# Altium schematic sheet PowerFull_car_engineSteering.SchDoc
size A4
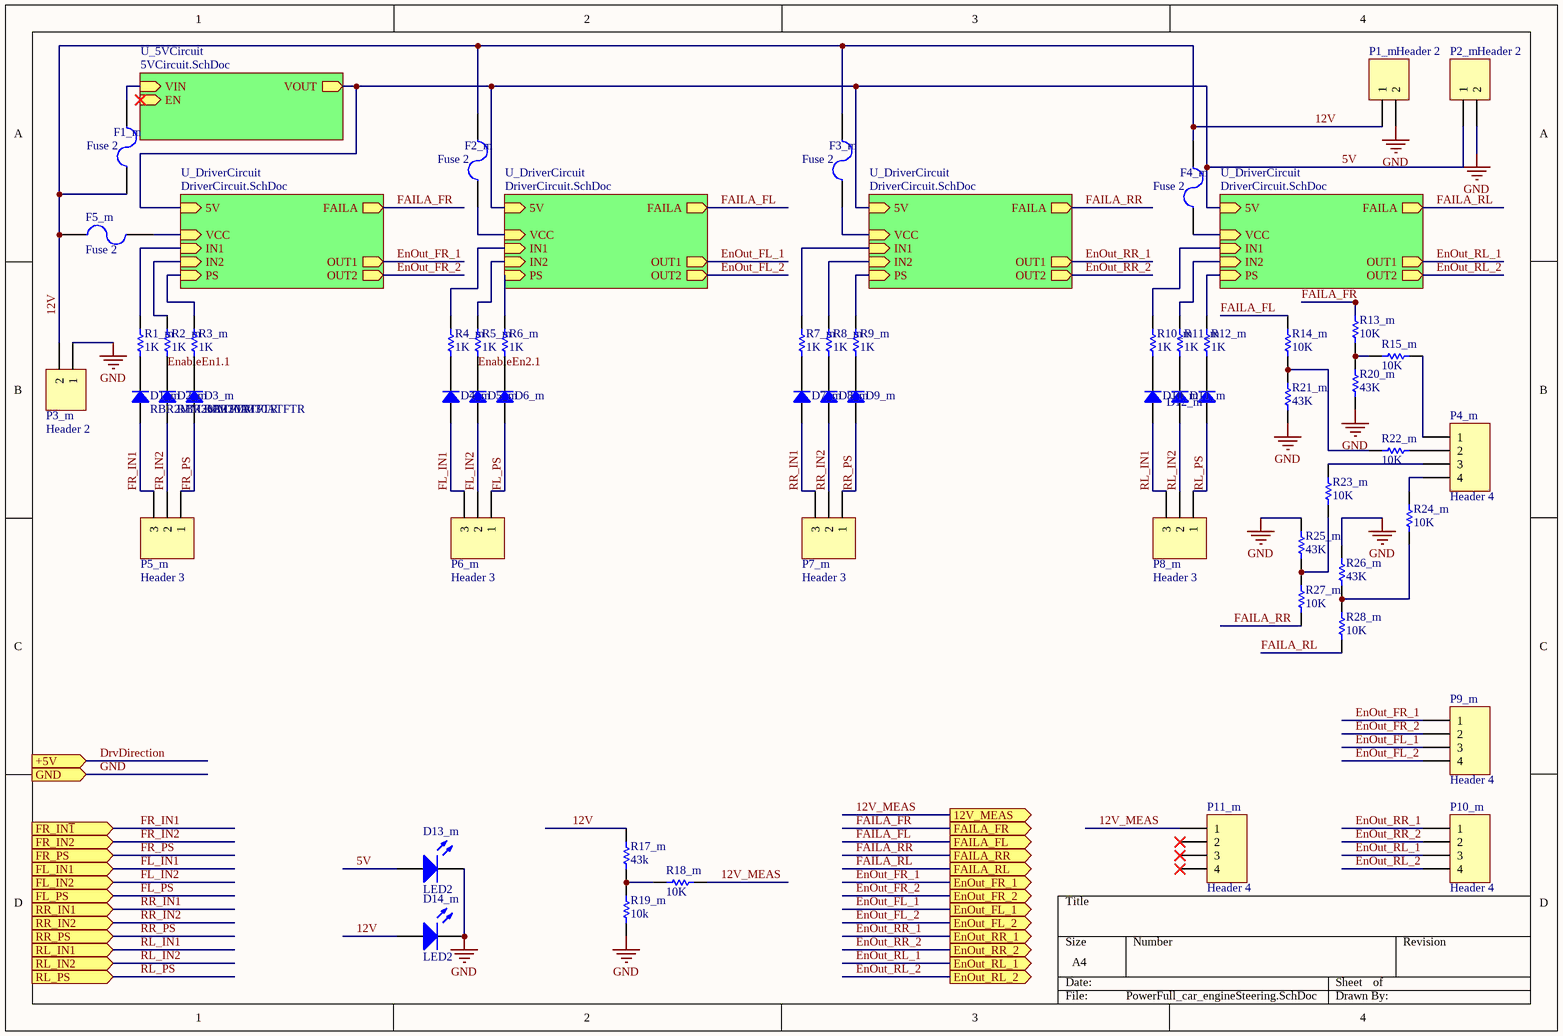
[diagram p0: PowerFull_car_engineSteering.SchDoc]

## Parts
D1_m  RBR2MM30ATFTR  [SOD123F]
D2_m  RBR2MM30ATFTR  [SOD123F]
D3_m  RBR2MM30ATFTR  [SOD123F]
D4_m  RBR2MM30ATFTR  [SOD123F]  (value not drawn)
D5_m  RBR2MM30ATFTR  [SOD123F]  (value not drawn)
D6_m  RBR2MM30ATFTR  [SOD123F]  (value not drawn)
D7_m  RBR2MM30ATFTR  [SOD123F]  (value not drawn)
D8_m  RBR2MM30ATFTR  [SOD123F]  (value not drawn)
D9_m  RBR2MM30ATFTR  [SOD123F]  (value not drawn)
D10_m  RBR2MM30ATFTR  [SOD123F]  (value not drawn)
D11_m  RBR2MM30ATFTR  [SOD123F]  (value not drawn)
D12_m  RBR2MM30ATFTR  [SOD123F]  (value not drawn)
D13_m  LED2  [1608[0603]]
D14_m  LED2  [1608[0603]]
F1_m  Fuse 2  [1608[0603]]
F2_m  Fuse 2  [1608[0603]]
F3_m  Fuse 2  [1608[0603]]
F4_m  Fuse 2  [1608[0603]]
F5_m  Fuse 2  [1608[0603]]
P1_m  Header 2  [HDR1X2]
P2_m  Header 2  [HDR1X2]
P3_m  Header 2  [HDR1X2]
P4_m  Header 4  [HDR1X4]
P5_m  Header 3  [HDR1X3]
P6_m  Header 3  [HDR1X3]
P7_m  Header 3  [HDR1X3]
P8_m  Header 3  [HDR1X3]
P9_m  Header 4  [HDR1X4]
P10_m  Header 4  [HDR1X4]
P11_m  Header 4  [HDR1X4]
R1_m  value 1K  [1608[0603]]  (hidden comment: Res1)
R2_m  value 1K  [1608[0603]]  (hidden comment: Res1)
R3_m  value 1K  [1608[0603]]  (hidden comment: Res1)
R4_m  value 1K  [1608[0603]]  (hidden comment: Res1)
R5_m  value 1K  [1608[0603]]  (hidden comment: Res1)
R6_m  value 1K  [1608[0603]]  (hidden comment: Res1)
R7_m  value 1K  [1608[0603]]  (hidden comment: Res1)
R8_m  value 1K  [1608[0603]]  (hidden comment: Res1)
R9_m  value 1K  [1608[0603]]  (hidden comment: Res1)
R10_m  value 1K  [1608[0603]]  (hidden comment: Res1)
R11_m  value 1K  [1608[0603]]  (hidden comment: Res1)
R12_m  value 1K  [1608[0603]]  (hidden comment: Res1)
R13_m  value 10K  [1608[0603]]  (hidden comment: Res1)
R14_m  value 10K  [1608[0603]]  (hidden comment: Res1)
R15_m  value 10K  [1608[0603]]  (hidden comment: Res1)
R17_m  value 43k  [1608[0603]]  (hidden comment: Res1)
R18_m  value 10K  [1608[0603]]  (hidden comment: Res1)
R19_m  value 10k  [1608[0603]]  (hidden comment: Res1)
R20_m  value 43K  [1608[0603]]  (hidden comment: Res1)
R21_m  value 43K  [1608[0603]]  (hidden comment: Res1)
R22_m  value 10K  [1608[0603]]  (hidden comment: Res1)
R23_m  value 10K  [1608[0603]]  (hidden comment: Res1)
R24_m  value 10K  [1608[0603]]  (hidden comment: Res1)
R25_m  value 43K  [1608[0603]]  (hidden comment: Res1)
R26_m  value 43K  [1608[0603]]  (hidden comment: Res1)
R27_m  value 10K  [1608[0603]]  (hidden comment: Res1)
R28_m  value 10K  [1608[0603]]  (hidden comment: Res1)

## Sub-sheets
U_5VCircuit = 5VCircuit.SchDoc: VIN (in), EN (in), VOUT (out)
U_DriverCircuit = DriverCircuit.SchDoc: 5V (in), FAILA (out), PS (in), VCC (in), OUT1 (out), OUT2 (out), IN1 (in), IN2 (in)
U_DriverCircuit = DriverCircuit.SchDoc: 5V (in), FAILA (out), PS (in), VCC (in), OUT1 (out), OUT2 (out), IN1 (in), IN2 (in)
U_DriverCircuit = DriverCircuit.SchDoc: 5V (in), FAILA (out), PS (in), VCC (in), OUT1 (out), OUT2 (out), IN1 (in), IN2 (in)
U_DriverCircuit = DriverCircuit.SchDoc: 5V (in), FAILA (out), PS (in), VCC (in), OUT1 (out), OUT2 (out), IN1 (in), IN2 (in)

## Ports
12V_MEAS (out), +5V (in), EnOut_FL_1 (out), EnOut_FL_2 (out), EnOut_FR_1 (out), EnOut_FR_2 (out), EnOut_RL_1 (out), EnOut_RL_2 (out), EnOut_RR_1 (out), EnOut_RR_2 (out), FAILA_FL (out), FAILA_FR (out), FAILA_RL (out), FAILA_RR (out), FL_IN1 (in), FL_IN2 (in), FL_PS (in), FR_IN2 (in), FR_IN~{1} (in), FR_PS (in), GND (in), RL_IN1 (in), RL_IN2 (in), RL_PS (in), RR_IN1 (in), RR_IN2 (in), RR_PS (in)

## Nets
GND: D13_m.2(K) D14_m.2(K) P1_m.2 P2_m.2 P3_m.1 R19_m.1 R20_m.1 R21_m.1 R25_m.2 R26_m.2 ; port GND
5V: D13_m.1(A) P2_m.1 ; sheet U_DriverCircuit/5V, sheet U_5VCircuit/VOUT, sheet U_DriverCircuit/5V, sheet U_DriverCircuit/5V, sheet U_DriverCircuit/5V
12V: D14_m.1(A) F1_m.1 F2_m.2 F3_m.2 F4_m.2 F5_m.2 P1_m.1 P3_m.2 R17_m.2
12V_MEAS: P11_m.1 R18_m.1 ; port 12V_MEAS
DrvDirection: port +5V
EnableEn1.1: D2_m.2 R2_m.1
EnableEn2.1: D5_m.2 R5_m.1
EnOut_FL_1: P9_m.3 ; port EnOut_FL_1, sheet U_DriverCircuit/OUT1
EnOut_FL_2: P9_m.4 ; port EnOut_FL_2, sheet U_DriverCircuit/OUT2
EnOut_FR_1: P9_m.1 ; port EnOut_FR_1, sheet U_DriverCircuit/OUT1
EnOut_FR_2: P9_m.2 ; port EnOut_FR_2, sheet U_DriverCircuit/OUT2
EnOut_RL_1: P10_m.3 ; port EnOut_RL_1, sheet U_DriverCircuit/OUT1
EnOut_RL_2: P10_m.4 ; port EnOut_RL_2, sheet U_DriverCircuit/OUT2
EnOut_RR_1: P10_m.1 ; port EnOut_RR_1, sheet U_DriverCircuit/OUT1
EnOut_RR_2: P10_m.2 ; port EnOut_RR_2, sheet U_DriverCircuit/OUT2
FAILA_FL: R14_m.2 ; port FAILA_FL, sheet U_DriverCircuit/FAILA
FAILA_FR: R13_m.2 ; port FAILA_FR, sheet U_DriverCircuit/FAILA
FAILA_RL: R28_m.1 ; port FAILA_RL, sheet U_DriverCircuit/FAILA
FAILA_RR: R27_m.1 ; port FAILA_RR, sheet U_DriverCircuit/FAILA
FL_IN1: D4_m.1 P6_m.3 ; port FL_IN1
FL_IN2: D5_m.1 P6_m.2 ; port FL_IN2
FL_PS: D6_m.1 P6_m.1 ; port FL_PS
FR_IN1: D1_m.1 P5_m.3 ; port FR_IN~{1}
FR_IN2: D2_m.1 P5_m.2 ; port FR_IN2
FR_PS: D3_m.1 P5_m.1 ; port FR_PS
RL_IN1: D10_m.1 P8_m.3 ; port RL_IN1
RL_IN2: D11_m.1 P8_m.2 ; port RL_IN2
RL_PS: D12_m.1 P8_m.1 ; port RL_PS
RR_IN1: D7_m.1 P7_m.3 ; port RR_IN1
RR_IN2: D8_m.1 P7_m.2 ; port RR_IN2
RR_PS: D9_m.1 P7_m.1 ; port RR_PS
NetD1_m_2: D1_m.2 R1_m.1
NetD3_m_2: D3_m.2 R3_m.1
NetD4_m_2: D4_m.2 R4_m.1
NetD6_m_2: D6_m.2 R6_m.1
NetD7_m_2: D7_m.2 R7_m.1
NetD8_m_2: D8_m.2 R8_m.1
NetD9_m_2: D9_m.2 R9_m.1
NetD10_m_2: D10_m.2 R10_m.1
NetD11_m_2: D11_m.2 R11_m.1
NetD12_m_2: D12_m.2 R12_m.1
NetF1_m_2: F1_m.2 ; sheet U_5VCircuit/VIN
NetF2_m_1: F2_m.1 ; sheet U_DriverCircuit/VCC
NetF3_m_1: F3_m.1 ; sheet U_DriverCircuit/VCC
NetF4_m_1: F4_m.1 ; sheet U_DriverCircuit/VCC
NetF5_m_1: F5_m.1 ; sheet U_DriverCircuit/VCC
NetP4_m_1: P4_m.1 R15_m.1
NetP4_m_2: P4_m.2 R22_m.1
NetP4_m_3: P4_m.3 R23_m.1
NetP4_m_4: P4_m.4 R24_m.1
NetR1_m_2: R1_m.2 ; sheet U_DriverCircuit/IN1
NetR2_m_2: R2_m.2 ; sheet U_DriverCircuit/IN2
NetR3_m_2: R3_m.2 ; sheet U_DriverCircuit/PS
NetR4_m_2: R4_m.2 ; sheet U_DriverCircuit/IN1
NetR5_m_2: R5_m.2 ; sheet U_DriverCircuit/IN2
NetR6_m_2: R6_m.2 ; sheet U_DriverCircuit/PS
NetR7_m_2: R7_m.2 ; sheet U_DriverCircuit/IN1
NetR8_m_2: R8_m.2 ; sheet U_DriverCircuit/IN2
NetR9_m_2: R9_m.2 ; sheet U_DriverCircuit/PS
NetR10_m_2: R10_m.2 ; sheet U_DriverCircuit/IN1
NetR11_m_2: R11_m.2 ; sheet U_DriverCircuit/IN2
NetR12_m_2: R12_m.2 ; sheet U_DriverCircuit/PS
NetR13_m_1: R13_m.1 R15_m.2 R20_m.2
NetR14_m_1: R14_m.1 R21_m.2 R22_m.2
NetR17_m_1: R17_m.1 R18_m.2 R19_m.2
NetR23_m_2: R23_m.2 R25_m.1 R27_m.2
NetR24_m_2: R24_m.2 R26_m.1 R28_m.2

Not connected (* = marked no-connect by the designer): P11_m 2* 3* 4*

## Library data of the parts
D1_m D2_m D3_m D4_m D5_m D6_m D7_m D8_m D9_m D10_m D11_m D12_m = RBR2MM30ATFTR: DIODE (RECTIFIER FRD) 30V-VR 2A-; Manufacturer: Rohm Semiconductor; Current - Average Rectified (Io): 2A; Current - Reverse Leakage @ Vr: 50µA @ 30V; Diode Type: Schottky; Speed: Fast Recovery =< 500ns, > 200mA (Io); Voltage - DC Reverse (Vr) (Max): 30V; Voltage - Forward (Vf) (Max) @ If: 530mV @ 2A; Part Number: RBR2MM30ATFTR; ComponentLink1Description: Datasheet; ComponentLink1URL: https://www.rohm.com/datasheet/RBR2MM30ATF/rbr2mm30atftr-e; ComponentLink2Description: DigiKey Link; ComponentLink2URL: http://digikey.com/product-detail/en/rohm-semiconductor/RBR2MM30ATFTR/RBR2MM30ATFCT-ND/9748240; LastUpdated: 02.09.2020 01:19:10; Lifecycle Status: Active; Minimum Order: 1; Mounting Type: Surface Mount; Operating Temperature - Junction: 150°C (Max); Package / Case: SOD-123F; Packaging: TapeAndReel; PartId: 2445; Part Status: Active; Price: 0.10; Series: Automotive, AEC-Q101; Supplier 1: DigiKey; Supplier Part Number 1: RBR2MM30ATFCT-ND; Supplier Device Package: PMDU
D13_m D14_m = LED2: Typical RED, GREEN, YELLOW, AMBER GaAs LED; Published: 8-Jun-2000; LatestRevisionDate: 17-Jul-2002; LatestRevisionNote: Re-released for DXP Platform.; PackageVersion: Feb-2002; PackageReference: 3.2X1.6X1.1; Publisher: Altium Limited; PackageDescription: SM LED; 2 Flat Leads
F1_m F2_m F3_m F4_m F5_m = Fuse 2: Fuse; Published: 8-Jun-2000; LatestRevisionDate: 17-Jul-2002; LatestRevisionNote: Re-released for DXP Platform.; PackageReference: PIN-W2/E2.8; Publisher: Altium Limited; PackageDescription: Thru-Hole; 2 Leads
P1_m P2_m P3_m = Header 2: Header, 2-Pin; LatestRevisionDate: 17-Jul-2002; LatestRevisionNote: Re-released for DXP Platform.; Publisher: Altium Limited
P4_m P9_m P10_m P11_m = Header 4: Header, 4-Pin; LatestRevisionDate: 17-Jul-2002; LatestRevisionNote: Re-released for DXP Platform.; Publisher: Altium Limited
P5_m P6_m P7_m P8_m = Header 3: Header, 3-Pin; LatestRevisionDate: 17-Jul-2002; LatestRevisionNote: Re-released for DXP Platform.; Publisher: Altium Limited
R1_m R2_m R3_m R4_m R5_m R6_m R7_m R8_m R9_m R10_m R11_m R12_m R13_m R14_m R15_m R17_m R18_m R19_m R20_m R21_m R22_m R23_m R24_m R25_m R26_m R27_m R28_m = Res1: Resistor; Published: 8-Jun-2000; LatestRevisionDate: 17-Jul-2002; LatestRevisionNote: Re-released for DXP Platform.; PackageReference: AXIAL-0.3; Publisher: Altium Limited; PackageDescription: Axial Device, Thru-Hole; 2 Leads; 0.3 in Pin Spacing